# Altium schematic sheet GSM.SchDoc
size A; SheetNumber: 4; SheetTotal: 10
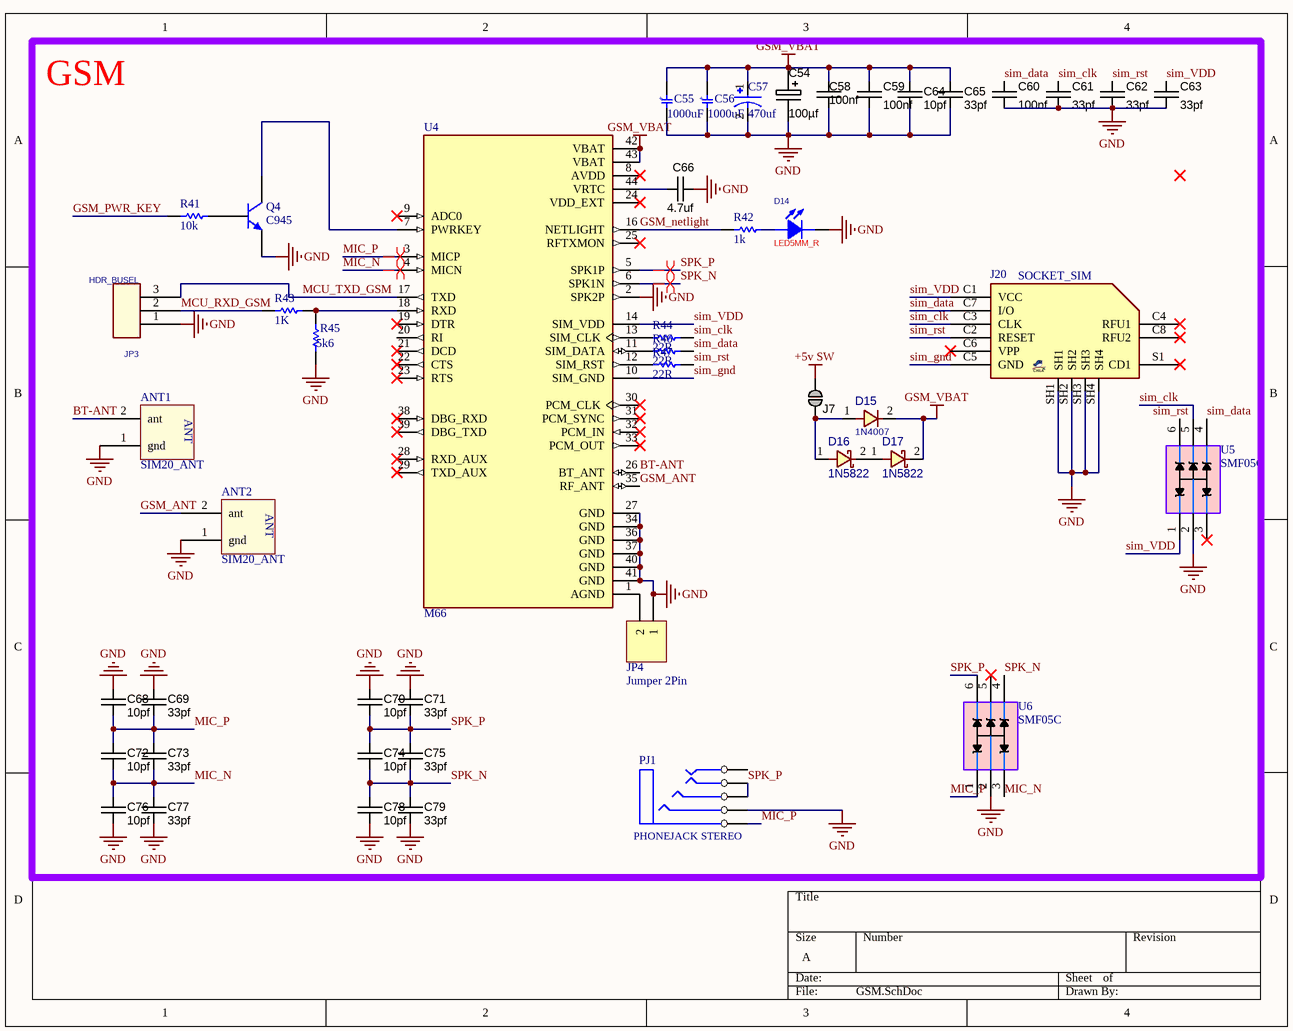
[diagram p0: GSM.SchDoc]

## Parts
ANT1  SIM20_ANT  [MY_SIM20_ANT]
ANT2  SIM20_ANT  [MY_SIM20_ANT]
C54  value 100µf  [CAPMP3528X210N]  (hidden comment: 100uf)
C55  1000uF  [Elko G]
C56  1000uF  [Elko G]
C57  470uf  [CAP_4TPB330ML]
C58  100nf  [CAPC1608X90N]
C59  100nf  [CAPC1608X90N]
C60  100nf  [CAPC1608X90N]
C61  33pf  [CAPC1608X90N]
C62  33pf  [CAPC1608X90N]
C63  33pf  [CAPC1608X90N]
C64  10pf  [CAPC1608X90N]
C65  33pf  [CAPC1608X90N]
C66  4.7uf  [CAPC1608X90N]
C68  10pf  [CAPC1608X90N]
C69  33pf  [CAPC1608X90N]
C70  10pf  [CAPC1608X90N]
C71  33pf  [CAPC1608X90N]
C72  10pf  [CAPC1608X90N]
C73  33pf  [CAPC1608X90N]
C74  10pf  [CAPC1608X90N]
C75  33pf  [CAPC1608X90N]
C76  10pf  [CAPC1608X90N]
C77  33pf  [CAPC1608X90N]
C78  10pf  [CAPC1608X90N]
C79  33pf  [CAPC1608X90N]
D14  LED5MM_R  [LED5MM_RED]
D15  1N4007  [D_SMA]
D16  1N5822  [D_SMA]
D17  1N5822  [D_SMA]
J7  Jumper  [JUMP1]  (value not drawn)  (no BOM)
J20  SOCKET_SIM  [SIM_MICRO_GCT]
JP3  HDR_BUSEL  [HDR_1x3]
JP4  Jumper 2Pin  [Jumper Small - 2.54 - Blue]
PJ1  PHONEJACK STEREO  [PHONE-J2-3.5MM]
Q4  C945  [SOT23_N]
R41  10k  [Resistor_SMD_0603 (1608)]
R42  1k  [Resistor_SMD_0603 (1608)]
R43  1K  [Resistor_SMD_0603 (1608)]
R44  22R  [Resistor_SMD_0603 (1608)]
R45  5k6  [Resistor_SMD_0603 (1608)]
R46  22R  [Resistor_SMD_0603 (1608)]
R47  22R  [Resistor_SMD_0603 (1608)]
U4  M66  [XCVR_M66]
U5  SMF05C  [SC706]
U6  SMF05C  [SC706]

## Nets
+5v SW: J7.1
GND: ANT1.1(gnd) ANT2.1(gnd) C54.2 C55.1 C56.1 C57.2 C58.1 C59.1 C60.1 C61.1 C62.1 C63.1 C64.1 C65.1 C66.2 C68.2 C69.2 C70.2 C71.2 C76.1 C77.1 C78.1 C79.1 D14.2(CATHODE) J20.SH1 J20.SH2 J20.SH3 J20.SH4 JP3.1 JP4.1 PJ1.GND Q4.2(E) R45.2 U4.2(SPK2P) U4.27(GND) U4.34(GND) U4.36(GND) U4.37(GND) U4.40(GND) U4.41(GND) U5.2(Gnd) U6.2(Gnd)
GSM_VBAT: C54.1 C55.2 C56.2 C57.1 C58.2 C59.2 C64.2 C65.2 D15.2 D17.2 U4.42(VBAT) U4.43(VBAT)
BT-ANT: ANT1.2(ant) U4.26(BT_ANT)
GSM_ANT: ANT2.2(ant) U4.35(RF_ANT)
GSM_netlight: R42.1 U4.16(NETLIGHT)
GSM_PWR_KEY: R41.1
MCU_RXD_GSM: JP3.2 R43.1
MCU_TXD_GSM: JP3.3 U4.17(TXD)
MIC_N: C72.1 C73.1 C76.2 C77.2 U4.4(MICN) U6.3(L3)
MIC_P: C68.1 C69.1 C72.2 C73.2 PJ1.MIC U4.3(MICP) U6.1(L1)
sim_clk: C61.2 J20.C3(CLK) R44.2 U5.5(L5)
sim_data: C60.2 J20.C7(I/O) R46.2 U5.4(L4)
sim_gnd: J20.C5(GND) U4.10(SIM_GND)
sim_rst: C62.2 J20.C2(RESET) R47.2
sim_VDD: C63.2 J20.C1(VCC) U4.14(SIM_VDD) U5.1(L1)
SPK_N: C74.1 C75.1 C78.2 C79.2 U4.6(SPK1N) U6.4(L4)
SPK_P: C70.1 C71.1 C74.2 C75.2 PJ1.EL PJ1.ER U4.5(SPK1P) U6.6(L6)
NetC66_1: C66.1 U4.44(VRTC)
NetD14_1: D14.1(ANODE) R42.2
NetD15_1: D15.1 D16.1 J7.2
NetD16_2: D16.2 D17.1
NetJP4_2: JP4.2 U4.1(AGND)
NetQ4_1: Q4.1(B) R41.2
NetQ4_3: Q4.3(C) U4.7(PWRKEY)
NetR43_2: R43.2 R45.1 U4.18(RXD)
NetR44_1: R44.1 U4.13(SIM_CLK)
NetR46_1: R46.1 U4.11(SIM_DATA)
NetR47_1: R47.1 U4.12(SIM_RST)

Not connected (* = marked no-connect by the designer): J20 C4(RFU1)* C6(VPP)* C8(RFU2)* S1(CD1)*; PJ1 PD(2); U4 8(AVDD)* 9(ADC0)* 19(DTR)* 20(RI) 21(DCD)* 22(CTS)* 23(RTS)* 24(VDD_EXT)* 25(RFTXMON)* 28(RXD_AUX)* 29(TXD_AUX)* 30(PCM_CLK)* 31(PCM_SYNC)* 32(PCM_IN)* 33(PCM_OUT)* 38(DBG_RXD)* 39(DBG_TXD)*; U5 3(L3)* 6(L6); U6 5(L5)*

## Layout directives
differential pair: MIC_N, MIC_P, SPK_N, SPK_P

## Notes on the sheet
- GSM
- Labels drawn without touching a wire or pin: sim_rst
- (in symbol Capacitor Electrical SMD) +

## Library data of the parts
ANT1 ANT2 = SIM20_ANT: ANT
C54 = CAPT_100u_1210_6V3: Capacitor SMD Tantalum 100uF 20% 6.3V 1210; Manufacturer 1: AVX Corporation; Manufacturer Part Number 1: TCJB107M006R0045; SCDType: spec; Package / Case: 1210 (3528 Metric); Tolerance: ±20%; Material: Tantalum; Supplier 1: Digi-Key; Supplier Part Number 1: 478-4711-1-ND
C55 C56 = Capacitor Electrical SMD: DatasheetVersion: 2021; ComponentLink1Description: Website Smart World; ComponentLink1URL: https://www.smartw.ir/; ComponentLink2Description: Telegram; ComponentLink2URL: https://t.me/altium_smartw; ComponentLink3Description: Instagram; ComponentLink3URL: https://Instagram.com/smartgw.ir
C57 = 4TPB330ML: CAP, 330ÂµF, 4V, 20%, 2917, SMD; Capacitance:330ÂµF; Voltage Rating:4V; Product Range:-; Capacitance Tolerance:Â± 20%; Manufacturer Size Code:D; ESR:0.04ohm; Operating Temperature Min:-55Â°C; Operating Temperature Max:105Â°C; Automotive Qualification Standard:-; Capacitance Tolerance Â±:Â± 20%; Capacitor Case Style:2917 [7343 Metric]; Capacitor Mounting:SMD; Capacitor Terminals:SMD; DC Ripple Current:2000mA; External Depth:2.8mm; External Length / Height:7.3mm; External Width:4.3mm; Leakage Current:132ÂµA; No. of Pins:2Pins; Operating Temperature Range:-55Â°C to +105Â°C; Reel Quantity:2500; Tantalum Capacitor Case:2917 [7343 Metric]; Tape Width:12mm; Tolerance +:20%; Tolerance -:20%; Voltage Rating V DC:4V; MF: Sanyo Electric; Availability: In Stock; Package: None; MP: 4TPB330ML; Value: *; Price: None; SnapEDA_Link: https://www.snapeda.com/parts/4TPB330ML/Sanyo/view-part/?ref=snap; Check_prices: https://www.snapeda.com/parts/4TPB330ML/Sanyo/view-part/?ref=eda
C58-C66 C68-C79 = CAPC_100n_0603_X7R_50V_10%: Capacitor SMD Cer 100nF 10% 50V X7R 0603; Manufacturer 1: AVX Corporation; Manufacturer Part Number 1: 06035C104KAT2A; Ratings: 50V; X7R; Material: ceramic; SCDType: spec; Value: 100n; Manufacturer 2: TDK Corporation; Manufacturer Part Number 2: C1608X7R1H104K; Package / Case: 0603 (1608 Metric); Tolerance: ±10%; Supplier 1: Digi-Key; Supplier Part Number 1: 478-5052-1-ND; ComponentLink1URL: http://www.avx.com/docs/Catalogs/cx7r.pdf; ComponentLink1Description: http://www.avx.com/docs/Catalogs/cx7r.pdf; Supplier 2: Digi-Key; Supplier Part Number 2: 445-1314-1-ND; ComponentLink2URL: http://product.tdk.com/capacitor/mlcc/en/documents/mlcc_commercial_general_en.pdf; ComponentLink2Description: http://product.tdk.com/capacitor/mlcc/en/documents/mlcc_commercial_general_en.pdf
D14 = LED5MM: LED LIGHTING; Designer: Abbas Basereh; Data: 16-12-2016; Link: *; Part.No: *
D15 = DIODE_SMD_1N4007: DIODE, GENERAL PURPOSE, 1000V/1A; MANF: Kingtronics; DESC: DESCRIPTION; PARAM: 1000V VRRM; PARAM2: 1A; MANF_P#: M7; ASSEMBLY: ASSEMBLY; PRICE: PRICE; VALUE: 1N4007
D16 D17 = DIODE_SMD_SCHOTTKY_1N5822: DIODE, SCHOTTKY, 40V, 3A; MANF: DIODES; DESC: DESCRIPTION; MANF_P#: 1N5822; ASSEMBLY: ASSEMBLY; PRICE: PRICE; PARAM2: 3A; PARAM: 40V; VALUE: 1N5822
J7 = JUMP1: SMD jumper
J20 = SIM_MICRO_GCT: SOCKET, SIM MICRO, PUSH/PUSH, SIM7100; MANF: GCT; DESC: MUP-C792; PRICE: 1.4$; MANF_P#: SIM7100; VALUE: SOCKET_SIM
JP3 = Header 1x3: header or jumper box
JP4 = Jumper 2Pin: Jumper, 2-Pin; Designer: Abbas Basereh; Data: 16-12-2016; Link: *
PJ1 = PHONEJACK STEREO SW
Q4 = C945: NPN Silicon Epitaxial Planar Transistor; Published: 2017-2-8; LatestRevisionDate: 2017; LatestRevisionNote: IPC-7351 Footprint Added.; DatasheetVersion: 2017; PackageVersion: 2017-2-8; PackageReference: SOT23; Publisher: Abbas Basereh; PackageDescription: 3-Pin SOT-23 Package 0.95 mm Pitch, 2.3 mm Lead Span; ComponentLink1Description: Manufacturer Link; ComponentLink1URL: http://www.taitroncomponents.com/; ComponentLink2Description: Datasheet; ComponentLink2URL: http://www.taitroncomponents.com/
R41 = Resistor: Resistor 0603; Email: razi.vesali@gmail.com; Published: 17-Jun-2016; LatestRevisionNote: Re-released for puplic; Publisher: Seyed Razi Vesali; Value: 10k
R42-R47 = Resistor: Resistor 0603; Email: razi.vesali@gmail.com; Value: 10k; Published: 17-Jun-2016; LatestRevisionNote: Re-released for puplic; Publisher: Seyed Razi Vesali
U4 = M66: M66 is an ultra-small quad-band GSM/GPRS module using LCC castellation packaging on the market. Based on the latest 2G chipset, it has the optimal performance in SMS & Data transmission and audio service even in harsh environment.; MF: Quectel; Availability: In Stock; Value: *; Price: None; Check_prices: https://www.snapeda.com/parts/M66/Quectel/view-part/?ref=eda; SnapEDA_Link: https://www.snapeda.com/parts/M66/Quectel/view-part/?ref=snap; MP: M66; Package: SMD-52 Quectel
U5 U6 = TVS Diode: TVS Diode Array  For ESD and Latch-Up Protection